# Altium schematic sheet 1_P1.schdoc.schdoc
size 309 x 223 mm; Symbol: Sheet-Symbol_A4; Device: Sheet-Symbol_A4; Company: 嘉立创EDA; Version: V1.0; Page Size: A4; @Project Name: Quadrotor_Aircraft; @Page Count: 1; @Update Date: 2024-07-08; @Create Date: 2024-07-05; @Schematic Name: Schematic1; @Page No: 1; @Page Name: P1
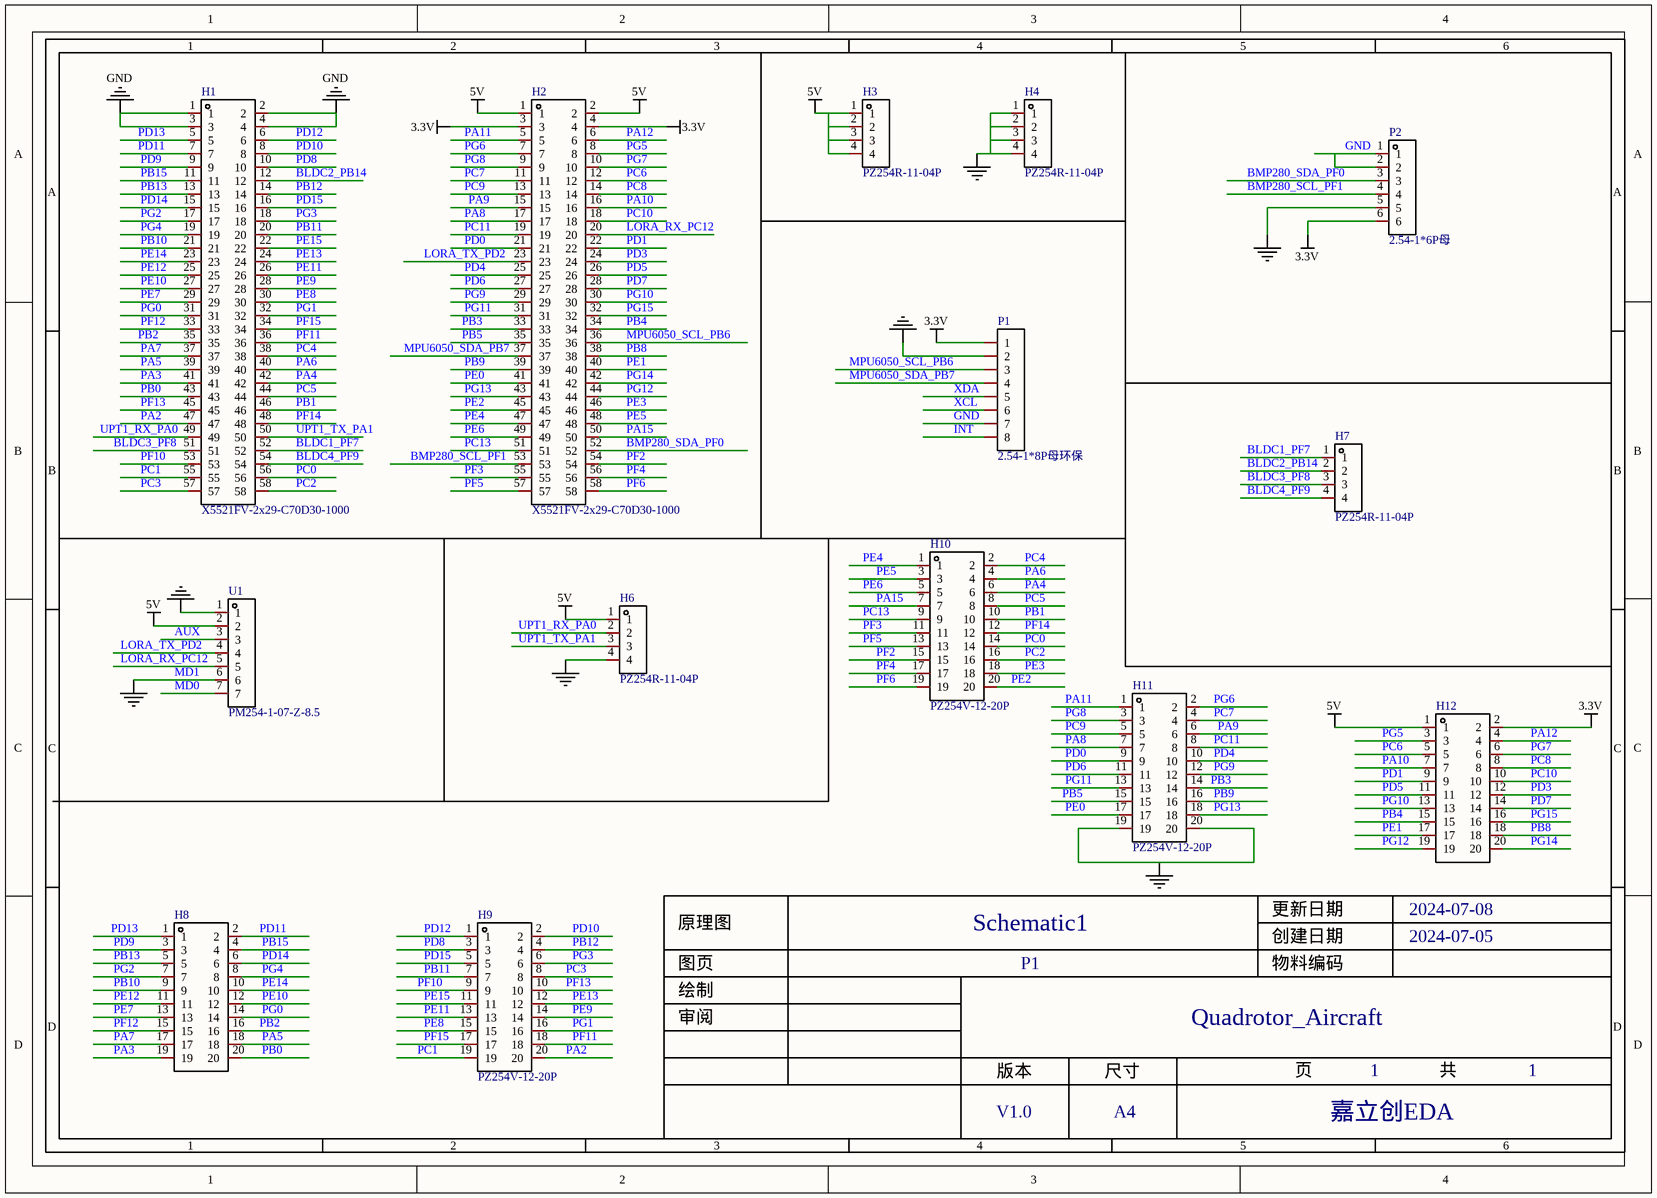
[diagram p0: 1_P1.schdoc.schdoc]

## Parts
H1  X5521FV-2x29-C70D30-1000  [HDR-TH_58P-P2.54-V-F-R2-C29-S2.54]
H2  X5521FV-2x29-C70D30-1000  [HDR-TH_58P-P2.54-V-F-R2-C29-S2.54]
H3  PZ254R-11-04P  [HDR-TH_4P-P2.54-H-M-W10.4]
H4  PZ254R-11-04P  [HDR-TH_4P-P2.54-H-M-W10.4]
H6  PZ254R-11-04P  [HDR-TH_4P-P2.54-H-M-W10.4]
H7  PZ254R-11-04P  [HDR-TH_4P-P2.54-H-M-W10.4]
H8  PZ254V-12-20P  [HDR-TH_20P-P2.54-V-M-R2-C10-S2.54]  (value not drawn)
H9  PZ254V-12-20P  [HDR-TH_20P-P2.54-V-M-R2-C10-S2.54]
H10  PZ254V-12-20P  [HDR-TH_20P-P2.54-V-M-R2-C10-S2.54]
H11  PZ254V-12-20P  [HDR-TH_20P-P2.54-V-M-R2-C10-S2.54]
H12  PZ254V-12-20P  [HDR-TH_20P-P2.54-V-M-R2-C10-S2.54]  (value not drawn)
P1  2.54-1*8P母环保  [HDR-TH_8P-P2.54-V-F-1]
P2  2.54-1*6P母  [HDR-TH_6P-P2.54-V-F]
U1  PM254-1-07-Z-8.5  [HDR-TH_7P-P2.54-V-F]

## Nets
3.3V: H2.3 H2.4 H12.2 P1.1 P2.6
5V: H2.1 H2.2 H3.1 H3.2 H3.3 H3.4 H6.1 H12.1 U1.2
GND: H1.1 H1.2 H1.3 H1.4 H4.1 H4.2 H4.3 H4.4 H6.4 H11.19 H11.20 P1.2 P1.7 P2.1 P2.2 P2.5 U1.1 U1.6  [also labelled MD1]
AUX: U1.3
BLDC1_PF7: H1.52 H7.1
BLDC2_PB14: H1.12 H7.2
BLDC3_PF8: H1.51 H7.3
BLDC4_PF9: H1.54 H7.4
BMP280_SCL_PF1: H2.53 P2.4
BMP280_SDA_PF0: H2.52 P2.3
INT: P1.8
LORA_RX_PC12: H2.20 U1.5
LORA_TX_PD2: H2.23 U1.4
MD0: U1.7
MPU6050_SCL_PB6: H2.36 P1.3
MPU6050_SDA_PB7: H2.37 P1.4
PA2: H1.47 H9.20
PA3: H1.41 H8.19
PA4: H1.42 H10.6
PA5: H1.39 H8.18
PA6: H1.40 H10.4
PA7: H1.37 H8.17
PA8: H2.17 H11.7
PA9: H2.15 H11.6
PA10: H2.16 H12.7
PA11: H2.5 H11.1
PA12: H2.6 H12.4
PA15: H2.50 H10.7
PB0: H1.43 H8.20
PB1: H1.46 H10.10
PB2: H1.35 H8.16
PB3: H2.33 H11.14
PB4: H2.34 H12.15
PB5: H2.35 H11.15
PB8: H2.38 H12.18
PB9: H2.39 H11.16
PB10: H1.21 H8.9
PB11: H1.20 H9.7
PB12: H1.14 H9.4
PB13: H1.13 H8.5
PB15: H1.11 H8.4
PC0: H1.56 H10.14
PC1: H1.55 H9.19
PC2: H1.58 H10.16
PC3: H1.57 H9.8
PC4: H1.38 H10.2
PC5: H1.44 H10.8
PC6: H2.12 H12.5
PC7: H2.11 H11.4
PC8: H2.14 H12.8
PC9: H2.13 H11.5
PC10: H2.18 H12.10
PC11: H2.19 H11.8
PC13: H2.51 H10.9
PD0: H2.21 H11.9
PD1: H2.22 H12.9
PD3: H2.24 H12.12
PD4: H2.25 H11.10
PD5: H2.26 H12.11
PD6: H2.27 H11.11
PD7: H2.28 H12.14
PD8: H1.10 H9.3
PD9: H1.9 H8.3
PD10: H1.8 H9.2
PD11: H1.7 H8.2
PD12: H1.6 H9.1
PD13: H1.5 H8.1
PD14: H1.15 H8.6
PD15: H1.16 H9.5
PE0: H2.41 H11.17
PE1: H2.40 H12.17
PE2: H2.45 H10.20
PE3: H2.46 H10.18
PE4: H2.47 H10.1
PE5: H2.48 H10.3
PE6: H2.49 H10.5
PE7: H1.29 H8.13
PE8: H1.30 H9.15
PE9: H1.28 H9.14
PE10: H1.27 H8.12
PE11: H1.26 H9.13
PE12: H1.25 H8.11
PE13: H1.24 H9.12
PE14: H1.23 H8.10
PE15: H1.22 H9.11
PF2: H2.54 H10.15
PF3: H2.55 H10.11
PF4: H2.56 H10.17
PF5: H2.57 H10.13
PF6: H2.58 H10.19
PF10: H1.53 H9.9
PF11: H1.36 H9.18
PF12: H1.33 H8.15
PF13: H1.45 H9.10
PF14: H1.48 H10.12
PF15: H1.34 H9.17
PG0: H1.31 H8.14
PG1: H1.32 H9.16
PG2: H1.17 H8.7
PG3: H1.18 H9.6
PG4: H1.19 H8.8
PG5: H2.8 H12.3
PG6: H2.7 H11.2
PG7: H2.10 H12.6
PG8: H2.9 H11.3
PG9: H2.29 H11.12
PG10: H2.30 H12.13
PG11: H2.31 H11.13
PG12: H2.44 H12.19
PG13: H2.43 H11.18
PG14: H2.42 H12.20
PG15: H2.32 H12.16
UPT1_RX_PA0: H1.49 H6.2
UPT1_TX_PA1: H1.50 H6.3
XCL: P1.6
XDA: P1.5

## Notes on the sheet
- 1
- 2
- 3
- 4
- 5
- 6
- A
- B
- C
- 原理图
- Schematic1
- 创建日期
- 更新日期
- 2024-07-08
- 2024-07-05
- 审阅
- 绘制
- 图页
- P1
- 物料编码
- Quadrotor_Aircraft
- D
- 版本
- 尺寸
- 页
- 共
- V1.0
- A4
- 嘉立创EDA

## Library data of the parts
H1 H2 = X5521FV-2x29-C70D30-1000: Manufacturer: XKB Connectivity(中国星坤); Add into BOM: yes; Holes Structure: 2x29P; Pitch: 2.54mm; Circular Hole / Square Hole: 圆孔; Number of Holes: 58P; Current Rating (Max): 3A; Holes Direction: 顶部; Soldering Temperature(Max): 260℃; Description: 插孔结构:2x29P;间距:2.54mm;行距:2.54mm;圆孔/方孔:圆孔;安装类型:直插;排数:双排;总孔位数:58P;额定电流:3A;额定电压:-;插孔方向:顶部;塑高:7mm;触头材质:黄铜;触头镀层:金;工作温度范围:-40℃~+105℃;焊接温度(最大值):260℃;; Name: X5521FV-2x29-C70D30-1000; Symbol: X5521FV-2X29-C70D30-1000; Device: X5521FV-2x29-C70D30-1000; Supplier: LCSC; Supplier Part: C2682213; Manufacturer Part: X5521FV-2x29-C70D30-1000; JLCPCB Part Class: 扩展库; LCSC Part Name: 间距:2.54mm 2x29P 直插; Supplier Footprint: 插件,P=2.54mm; Datasheet: https://atta.szlcsc.com/upload/public/pdf/source/20210108/C2682197_06F7869BD6CE28D3571C9D5993C38392.pdf; Convert to PCB: yes; Row Spacing: 2.54mm; Mounting Type: 直插; Number of Rows: 双排; Voltage Rating (Max): -; Insulation Height: 7mm; Contact Material: 黄铜; Contact Plating: 金; Operating Temperature Range: -40℃~+105℃
H3 H4 H6 H7 = PZ254R-11-04P: Manufacturer: XFCN(兴飞); Add into BOM: yes; Pin Structure: 1x4P; Pitch: 2.54mm; Circluar Pins/Square Pins: 方针; Description: 插针结构:1x4P;间距:2.54mm;行距:-;圆针/方针:方针;安装类型:弯插;排数:单排;总PIN位数:4P;额定电流:-;额定电压:-;配合针长度:6mm;塑高:2.5mm;触头材质:黄铜;触头镀层:-;工作温度范围:-40℃~+105℃;颜色:黑色;; Name: PZ254R-11-04P; Symbol: PZ254R-11-04P; Device: PZ254R-11-04P; LCSC Part Name: 间距:2.54mm 1x4P 弯插 方针; Supplier Part: C492412; Manufacturer Part: PZ254R-11-04P; Supplier Footprint: 弯插,P=2.54mm; JLCPCB Part Class: 扩展库; Datasheet: https://atta.szlcsc.com/upload/public/pdf/source/20200309/C492412_B0EFFC1946AB079B8871416C4A09EF6C.pdf; Supplier: LCSC; Convert to PCB: yes; Row Spacing: -; Mounting Type: 弯插; Number of Rows: 单排; Number of Pins: 4P; Current Rating (Max): -; Voltage Rating (Max): -; Length of Mating Pin: 6mm; Insulation Height: 2.5mm; Contact Material: 黄铜; Contact Plating: -; Operating Temperature Range: -40℃~+105℃; Color: 黑色
H8-H12 = PZ254V-12-20P: Manufacturer: XFCN(兴飞); Add into BOM: yes; Pin Structure: 2x10P; Pitch: 2.54mm; Circluar Pins/Square Pins: 方针; Description: 插针结构:2x10P;间距:2.54mm;行距:2.54mm;圆针/方针:方针;安装类型:直插;排数:双排;总PIN位数:20P;额定电流:-;额定电压:-;配合针长度:6mm;塑高:2.5mm;端接针长度:3mm;触头材质:黄铜;触头镀层:-;工作温度范围:-40℃~+105℃;颜色:黑色;; Name: PZ254V-12-20P; Symbol: PZ254V-12-20P; Device: PZ254V-12-20P; LCSC Part Name: 间距:2.54mm 2x10P 直插 方针; Supplier Part: C492427; Manufacturer Part: PZ254V-12-20P; Supplier Footprint: 插件,P=2.54mm; JLCPCB Part Class: 扩展库; Datasheet: https://atta.szlcsc.com/upload/public/pdf/source/20200309/C492427_9411E93D35F2EC20CED9A3ED9F4BBE60.pdf; Supplier: LCSC; Convert to PCB: yes; Row Spacing: 2.54mm; Mounting Type: 直插; Number of Rows: 双排; Number of Pins: 20P; Current Rating (Max): -; Voltage Rating (Max): -; Length of Mating Pin: 6mm; Insulation Height: 2.5mm; Length of End Connection Pin: 3mm; Contact Material: 黄铜; Contact Plating: -; Operating Temperature Range: -40℃~+105℃; Color: 黑色
P1 = 2.54-1*8P母环保: Manufacturer: BOOMELE(博穆精密); Symbol: Header-Female-2.54_1x8; Add into BOM: yes; Holes Structure: 1x8P; Pitch: 2.54mm; Number of Holes: 8P; Description: 插孔结构:1x8P;间距:2.54mm;行距:-;安装类型:直插;排数:单排;总孔位数:8P;塑高:-;触头材质:-;触头镀层:-;; Name: 2.54-1*8P母环保; Device: 2.54-1*8P母环保; Supplier: LCSC; Manufacturer Part: 2.54-1*8P母环保; Supplier Part: C27438; JLCPCB Part Class: 扩展库; LCSC Part Name: 间距:2.54mm 1x8P 直插; Supplier Footprint: 插件,P=2.54mm; Datasheet: https://atta.szlcsc.com/upload/public/pdf/source/20231221/1CA800C6799ED97958773716FAA1BFFE.pdf; Convert to PCB: yes; Row Spacing: -; Mounting Type: 直插; Number of Rows: 单排; Insulation Height: -; Contact Material: -; Contact Plating: -
P2 = 2.54-1*6P母: Manufacturer: BOOMELE(博穆精密); Symbol: Header-Female-2.54_1x6; Add into BOM: yes; Holes Structure: 1x6P; Pitch: 2.54mm; Number of Holes: 6P; Description: 插孔结构:1x6P;间距:2.54mm;行距:-;安装类型:直插;排数:单排;总孔位数:6P;塑高:-;触头材质:-;触头镀层:-;; Name: 2.54-1*6P母; Device: 2.54-1*6P母; Supplier: LCSC; Manufacturer Part: 2.54-1*6P母; Supplier Part: C40877; JLCPCB Part Class: 扩展库; LCSC Part Name: 间距:2.54mm 1x6P 直插; Supplier Footprint: 插件,P=2.54mm; Datasheet: https://atta.szlcsc.com/upload/public/pdf/source/20210301/C2718488_F4427B881E42CAA8DDB0B1C12B3A522C.pdf; Convert to PCB: yes; Row Spacing: -; Mounting Type: 直插; Number of Rows: 单排; Insulation Height: -; Contact Material: -; Contact Plating: -
U1 = PM254-1-07-Z-8.5: Manufacturer: HCTL(华灿天禄); Add into BOM: yes; Holes Structure: 1x7P; Pitch: 2.54mm; Circular Hole / Square Hole: 方孔; Number of Holes: 7P; Current Rating (Max): 3A; Holes Direction: 顶部; Soldering Temperature(Max): 260℃@5S; Description: 插孔结构:1x7P;间距:2.54mm;行距:-;圆孔/方孔:方孔;安装类型:直插;排数:单排;总孔位数:7P;额定电流:3A;额定电压:-;插孔方向:顶部;塑高:8.5mm;触头材质:铜合金;工作温度范围:-40℃~+105℃;焊接温度(最大值):260℃@5S;; Name: PM254-1-07-Z-8.5; Symbol: PM254-1-07-Z-8.5; Device: PM254-1-07-Z-8.5; LCSC Part Name: 1x7P 间距:2.54mm 直插; Supplier Part: C2897370; Manufacturer Part: PM254-1-07-Z-8.5; Supplier Footprint: 插件,P=2.54mm; JLCPCB Part Class: 扩展库; Datasheet: https://atta.szlcsc.com/upload/public/pdf/source/20230609/534BE42964C679BDE98E061007C4ABD6.pdf; Supplier: LCSC; Convert to PCB: yes; Row Spacing: -; Mounting Type: 直插; Number of Rows: 单排; Voltage Rating (Max): -; Insulation Height: 8.5mm; Contact Material: 铜合金; Operating Temperature Range: -40℃~+105℃